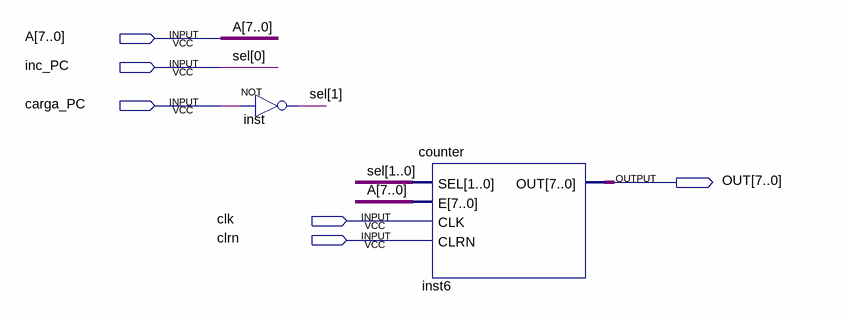
[diagram p0: schematic sheet]
// Quartus schematic pc.bdf as structural Verilog: 2 symbols, 6 pins
module pc (
  input  [7:0] A,
  input  inc_PC,
  input  carga_PC,
  input  clk,
  input  clrn,
  output [7:0] OUT
);

  wire [1:1] sel;

  not inst (sel[1], carga_PC);
  counter inst6 (.SEL({sel[1], inc_PC}), .E(A), .CLK(clk), .CLRN(clrn), .OUT(OUT));

  // Other names for the same wires on the sheet: sel[0] = inc_PC
endmodule
